# Altium schematic sheet 4_IMU.SchDoc: IMUs
size A4; DrawnBy: Sara V. Martinez; Engineer: Flight; Revision: V0.0; SheetNumber: 4; SheetTotal: 7
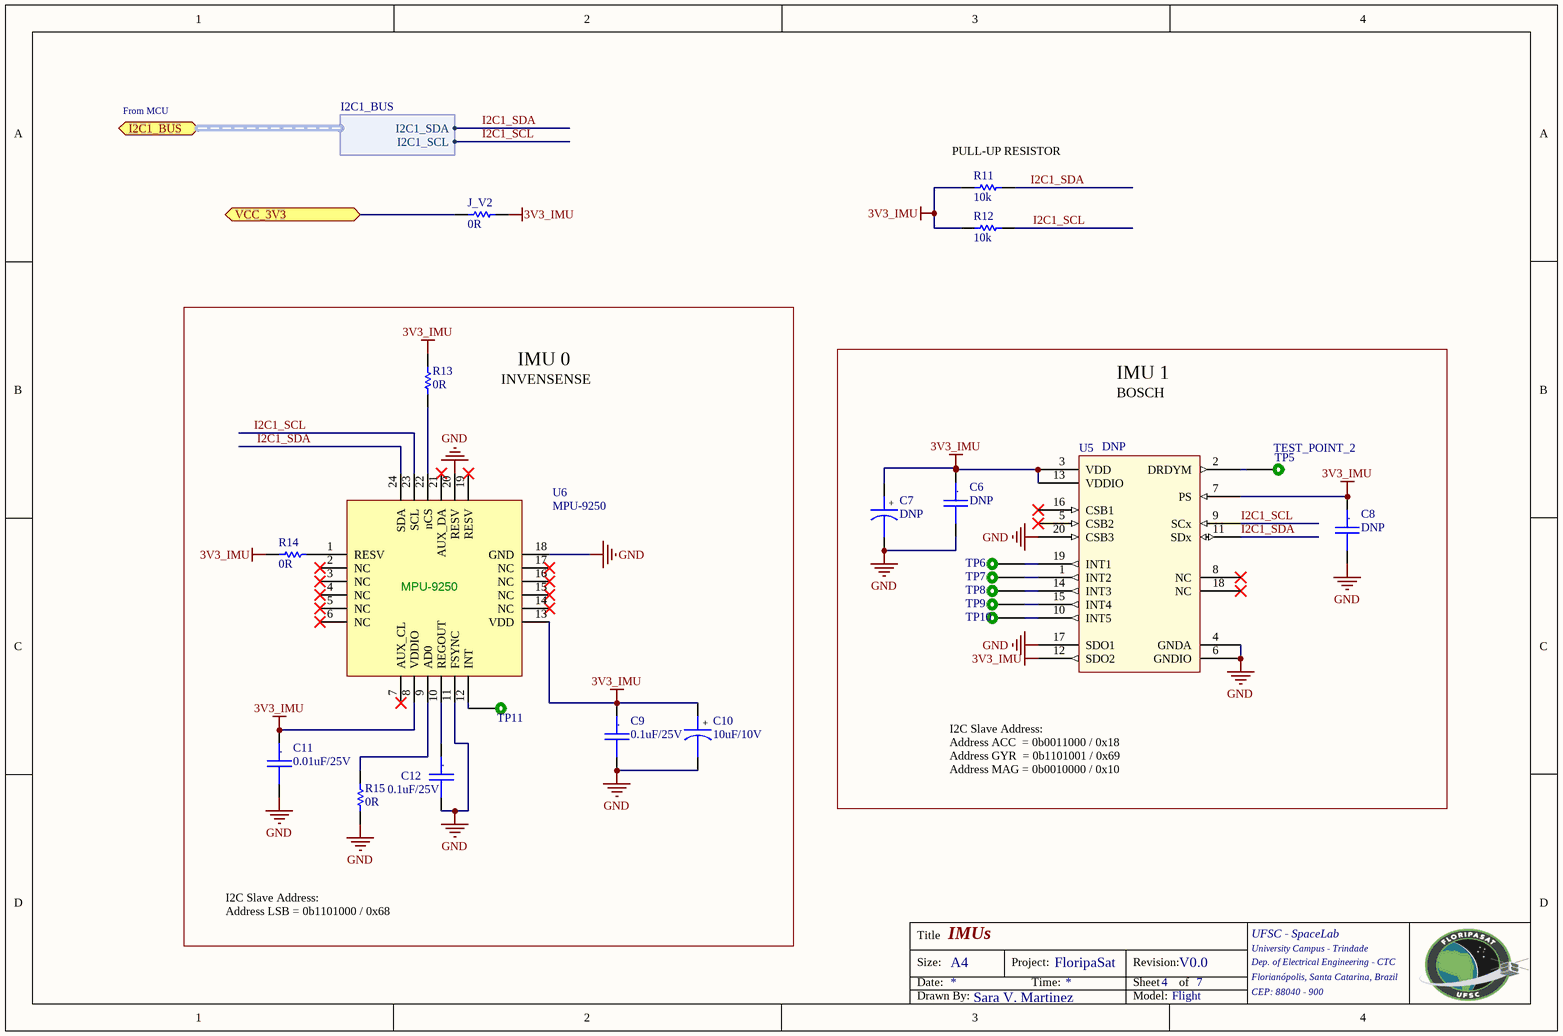
[diagram p0: 4_IMU.SchDoc]

## Parts
C6  DNP  [CC0805]
C7  DNP  [CC0805_Tantalum]
C8  DNP  [CC0805]
C9  0.1uF/25V  [CC0805]
C10  10uF/10V  [CC0805_Tantalum]
C11  0.01uF/25V  [CC0805]
C12  0.1uF/25V  [CC0805]
J_V2  0R  [0805]
R11  10k  [0805]
R12  10k  [0805]
R13  0R  [0805]
R14  0R  [0805]
R15  0R  [0805]
TP5  TEST_POINT_2  [TEST_POINT_2]  (no BOM)
TP6  TEST_POINT_2  [TEST_POINT_2]  (value not drawn)  (no BOM)
TP7  TEST_POINT_2  [TEST_POINT_2]  (value not drawn)  (no BOM)
TP8  TEST_POINT_2  [TEST_POINT_2]  (value not drawn)  (no BOM)
TP9  TEST_POINT_2  [TEST_POINT_2]  (value not drawn)  (no BOM)
TP10  TEST_POINT_2  [TEST_POINT_2]  (value not drawn)  (no BOM)
TP11  TEST_POINT_2  [TEST_POINT_2]  (value not drawn)  (no BOM)
U5  DNP  [LGA20]
U6  MPU-9250  [QFN24P300X300X105-25N]

## Blocks framed on the sheet
IMU 0: C9-C12 R13-R15 TP11 U6
IMU 1: C6-C8 TP5-TP10 U5

## Ports
I2C1_BUS (harness I2C1_BUS), VCC_3V3

## Harnesses
I2C1_BUS: I2C1_SCL, I2C1_SDA

## Nets
3V3_IMU: C6.1 C7.1 C8.1 C9.1 C10.1 C11.1 J_V2.1 R11.2 R12.2 R13.2 R14.2 U5.3(VDD) U5.7(PS) U5.12(SDO2) U5.13(VDDIO) U6.8(VDDIO) U6.13(VDD)
GND: C6.2 C7.2 C8.2 C9.2 C10.2 C11.2 C12.2 R15.2 U5.4(GNDA) U5.6(GNDIO) U5.17(SDO1) U5.20(CSB3) U6.11(FSYNC) U6.18(GND) U6.20(RESV)
I2C1_SCL: R12.1 U5.9(SCx) U6.23(SCL) ; port I2C1_BUS.I2C1_SCL
I2C1_SDA: R11.1 U5.11(SDx) U6.24(SDA) ; port I2C1_BUS.I2C1_SDA
VCC_3V3: J_V2.2 ; port VCC_3V3
NetC12_1: C12.1 U6.10(REGOUT)
NetR13_1: R13.1 U6.22(nCS)
NetR14_1: R14.1 U6.1(RESV)
NetR15_1: R15.1 U6.9(AD0)
NetTP5_1: TP5.1 U5.2(DRDYM)
NetTP6_1: TP6.1 U5.19(INT1)
NetTP7_1: TP7.1 U5.1(INT2)
NetTP8_1: TP8.1 U5.14(INT3)
NetTP9_1: TP9.1 U5.15(INT4)
NetTP10_1: TP10.1 U5.10(INT5)
NetTP11_1: TP11.1 U6.12(INT)

Not connected (* = marked no-connect by the designer): U5 5(CSB2)* 8(NC)* 16(CSB1)* 18(NC)*; U6 2(NC)* 3(NC)* 4(NC)* 5(NC)* 6(NC)* 7(AUX_CL)* 14(NC)* 15(NC)* 16(NC)* 17(NC)* 19(RESV)* 21(AUX_DA)*

## Notes on the sheet
- From MCU
- (near R11) PULL-UP RESISTOR
- INVENSENSE
- BOSCH
- I2C Slave Address:
  Address ACC  = 0b0011000 / 0x18
  Address GYR  = 0b1101001 / 0x69
  Address MAG = 0b0010000 / 0x10
- I2C Slave Address:
  Address LSB = 0b1101000 / 0x68
- Title
- Size:
- Date:
- A4
- Project:
- Time:
- FloripaSat
- Revision:
- Sheet
- of
- UFSC - SpaceLab
- University Campus - Trindade
- Dep. of Electrical Engineering - CTC
- Florianópolis, Santa Catarina, Brazil
- Drawn By:
- Model:
- CEP: 88040 - 900
- (in symbol Cap_Cer_X7R_0.1uF_25V_0805) .
- (in symbol Cap_Cer_X7R_0.01uF_50V_0805) .
- (in symbol Cap_Tant_SMD_10uF_10V_0805) +

## Library data of the parts
C6 C8 C9 C12 = Cap_Cer_X7R_0.1uF_25V_0805: CAP CER 0.1UF 25V 10% X7R 0805; Partnumber: CC0805KRX7R8BB104; NCM: 8532.24.10
C7 C10 = Cap_Tant_SMD_10uF_10V_0805: CAP Tantalum 10uF 10V 20% 0805; Partnumber: TPSP106M010R2000; NCM: 8532.21.11
C11 = Cap_Cer_X7R_0.01uF_50V_0805: CAP CER 0.01uF 25V 10% X7R 0805; Partnumber: CL21B103KAANNNC; NCM: 8532.24.10
J_V2 R13-R15 = R0R_JUMPER_1/16W_0805: RES 0R OHM 1/16W JUMPER 0805; Partnumber: CRCW08050000Z0EA; NCM: 8533.21.20
R11 R12 = R10k_1%_1/8W_0805: RES 10K OHM 1/8W 1%  0805; Partnumber: CRCW080510K0FKEA; NCM: 8533.21.20
TP5-TP11 = TEST_POINT_2: Test point
U5 = BMX055
U6 = MPU9250: SMD Gyroscope/Accelerometer/Magnetometer Sensor; 9-AXIS; Partnumber: MPU-9250